# Altium schematic sheet Circuit_Altium.schdoc
size 141 x 131 mm
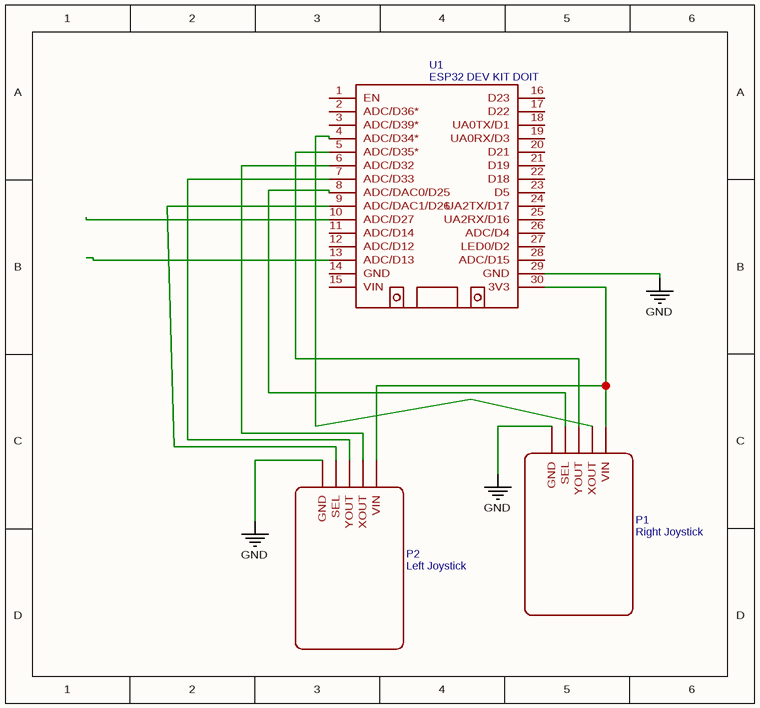
[diagram p0: Circuit_Altium.schdoc]

## Parts
P1  Right Joystick  [JOYSTICK]
P2  Left Joystick  [JOYSTICK]
U1  ESP32 DEV KIT DOIT  [DOIT-ESP32-DEVKIT-V1]

## Nets
GND: P1.GND P2.GND U1.29(GND)
NetP1_Key: P1.Key(SEL) U1.8(ADC/DAC0/D25)
NetP1_VCC: P1.VCC(VIN) P2.VCC(VIN) U1.30(3V3)
NetP1_XOUT: P1.XOUT U1.4(ADC/D34*)
NetP1_YOUT: P1.YOUT U1.5(ADC/D35*)
NetP2_Key: P2.Key(SEL) U1.9(ADC/DAC1/D26)
NetP2_XOUT: P2.XOUT U1.6(ADC/D32)
NetP2_YOUT: P2.YOUT U1.7(ADC/D33)

Not connected (* = marked no-connect by the designer): U1 1(EN) 2(ADC/D36*) 3(ADC/D39*) 10(ADC/D27) 11(ADC/D14) 12(ADC/D12) 13(ADC/D13) 14(GND) 15(VIN) 16(D23) 17(D22) 18(UA0TX/D1) 19(UA0RX/D3) 20(D21) 21(D19) 22(D18) 23(D5) 24(UA2TX/D17) 25(UA2RX/D16) 26(ADC/D4) 27(LED0/D2) 28(ADC/D15)

## Library data of the parts
P1 = Right Joystick: sourceId: 1T5FDZYC8; timeStamp: 1459417765; Supplier: AdaFruit; spicePre: P; spiceSymbolName: JOYSTICK CPY
P2 = Left Joystick: sourceId: 1T5FDZYC8; timeStamp: 1459417765; Supplier: AdaFruit; spicePre: P; spiceSymbolName: JOYSTICK CPY
U1 = ESP32 DEV KIT DOIT: Contributor: michael.garcia.h; spicePre: U; spiceSymbolName: ESP32 DEV KIT DOIT